# EAGLE design eth2rs485 (EAGLE 9.6.2)
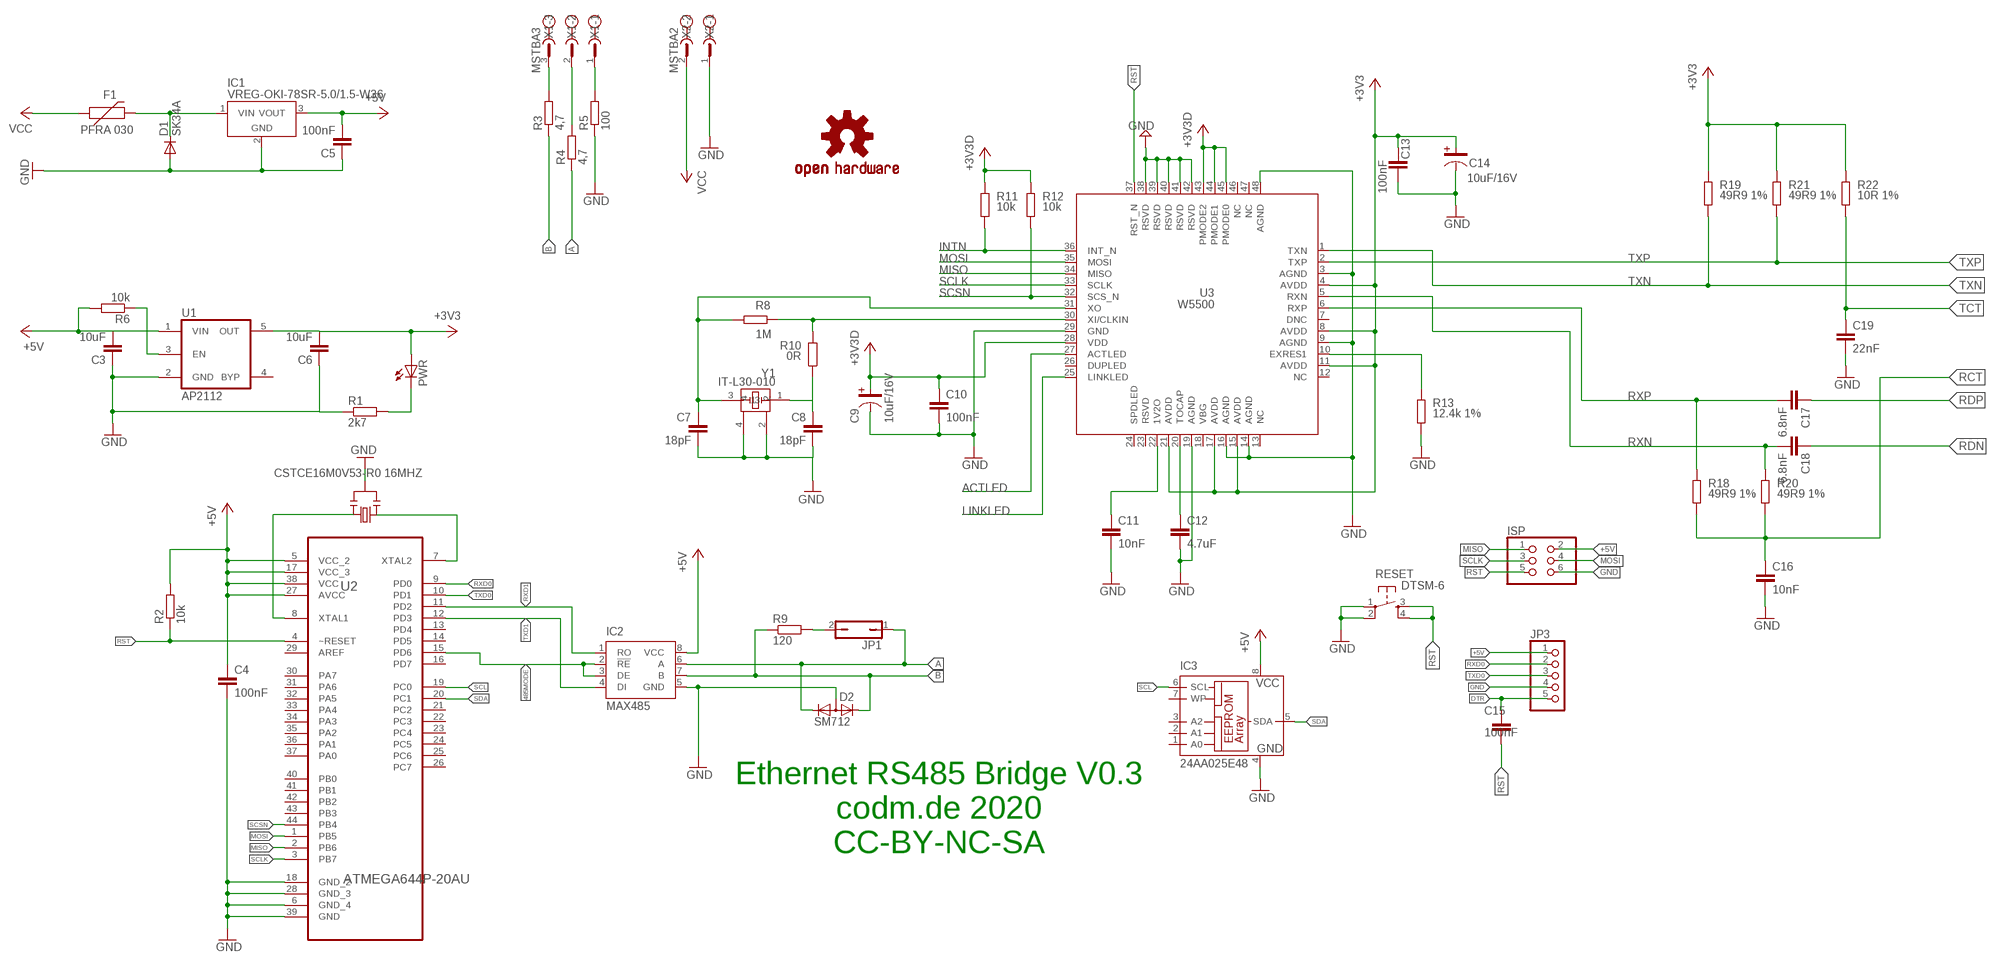
[diagram p0: schematic, sheet 1, part 1 of 2]
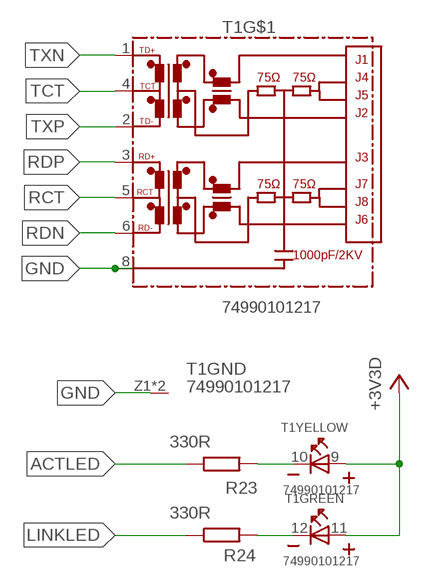
[diagram p1: schematic, sheet 1, part 2 of 2]

## Parts
C3  10uF  C-EUC0805  [C0805]
C4  100nF  C-EUC0805  [C0805]
C5  100nF  C-EUC0805  [C0805]
C6  10uF  C-EUC0805  [C0805]
C7  18pF  C-EUC0805  [C0805]
C8  18pF  C-EUC0805  [C0805]
C9  10uF/16V  C-3216(TANTAL)  [C-3216(TANTAL)]
C10  100nF  C-EUC0805  [C0805]
C11  10nF  C-EUC0805  [C0805]
C12  4.7uF  C-EUC0805  [C0805]
C13  100nF  C-EUC0805  [C0805]
C14  10uF/16V  C-3216(TANTAL)  [C-3216(TANTAL)]
C15  100nF  C-EUC0805  [C0805]
C16  10nF  C-EUC0805  [C0805]
C17  6.8nF  C-EUC0805  [C0805]
C18  6.8nF  C-EUC0805  [C0805]
C19  22nF  C-EUC0805  [C0805]
D1  SK34A  DIODE-DO214AC  [DO214AC]
D2  SM712  DIODE-2CA|ACSOT23  [SOT23]
F1  PFRA 030  PPTC_PTH  [PTH]
IC1  VREG-OKI-78SR-5.0/1.5-W36  [OKI-78SR]
IC2  MAX485  LTC485S  [SOIC8]
IC3  24AA025E48  24AA02SN  [SO-08]
ISP  PINHD-2X3  [2X03]
JP1  JP1Q  [JP1]
JP3  PINHD-1X5  [1X05]
LOGO1  OSHW-LOGOM  [OSHW-LOGO-M]
PWR  LEDCHIP-LED0805  [CHIP-LED0805]
R1  2k7  R-EU_R0805  [R0805]
R2  10k  R-EU_R0805  [R0805]
R3  4,7  R-EU_R0805  [R0805]
R4  4,7  R-EU_R0805  [R0805]
R5  100  R-EU_R0805  [R0805]
R6  10k  R-EU_R0805  [R0805]
R8  1M  R-EU_R0805  [R0805]
R9  120  R-EU_R0805  [R0805]
R10  0R  R-EU_R0805  [R0805]
R11  10k  R-EU_R0805  [R0805]
R12  10k  R-EU_R0805  [R0805]
R13  12.4k 1%  R-EU_R0805  [R0805]
R18  49R9 1%  R-EU_R0805  [R0805]
R19  49R9 1%  R-EU_R0805  [R0805]
R20  49R9 1%  R-EU_R0805  [R0805]
R21  49R9 1%  R-EU_R0805  [R0805]
R22  10R 1%  R-EU_R0805  [R0805]
R23  330R  R-EU_R0805  [R0805]
R24  330R  R-EU_R0805  [R0805]
RESET  DTSM-6  [DTSM-6]
T1  74990101217  WE-RJ45_74990111217  [74990111217]
U1  AP2112  AP2210K  [SOT23-5]
U2  ATMEGA644P-20AU  [QFP80P1200X1200X120-44N]
U3  W5500  [W5500]
X1  MSTBA3  [MSTBA3]
X2  MSTBA2  [MSTBA2]
Y1  IT-L30-010  [IT-L30-010]
Y2  CSTCE16M0V53-R0 16MHZ  RESONATORMU  [RESONATOR]

## Nets
485MODE: IC2.2(!RE) IC2.3(DE) U2.15(PD6)
+3V3: C6.2 C9.1 C10.1 C13.1 C14.1 PWR.A R11.2 R12.2 R19.2 R21.2 R22.2 T1.9(YELLOW:A) T1.11(GREEN:A) U1.5(OUT) U3.4(AVDD) U3.8(AVDD) U3.11(AVDD) U3.15(AVDD) U3.17(AVDD) U3.21(AVDD) U3.28(VDD) U3.43(PMODE2) U3.44(PMODE1) U3.45(PMODE0) ; supply symbol labelled +3V3D
+5V: C3.2 C4.1 C5.2 IC1.3(VOUT) IC2.8(VCC) IC3.8(VCC) ISP.2 JP3.1 R2.2 R6.2 U1.1(VIN) U2.5(VCC_2) U2.17(VCC_3) U2.27(AVCC) U2.38(VCC)
A: D2.1(K1) IC2.6(A) JP1.1 R4.1
ACTLED: R23.1 U3.27(ACTLED)
B: D2.2(K2) IC2.7(B) R3.1 R9.1
DTR: C15.1 JP3.5
GND: C3.1 C4.2 C5.1 C6.1 C7.2 C8.2 C9.2 C10.2 C11.2 C12.2 C13.2 C14.2 C16.2 C19.2 D1.A D2.3(A) IC1.2(GND) IC2.5(GND) IC3.4(GND) ISP.6 JP3.4 R1.1 R5.1 R13.1 RESET.1 RESET.2 T1.8 T1.Z1(GND:GND) T1.Z2(GND:GND) U1.2(GND) U2.6(GND_4) U2.18(GND_2) U2.28(GND_3) U2.39(GND) U3.3(AGND) U3.9(AGND) U3.14(AGND) U3.16(AGND) U3.19(AGND) U3.29(GND) U3.38(RSVD) U3.39(RSVD) U3.40(RSVD) U3.41(RSVD) U3.42(RSVD) U3.48(AGND) X2.1 Y1.2 Y1.4 Y2.2
INTN: R11.1 U3.36(INT_N)
LINKLED: R24.1 U3.25(LINKLED)
MISO: ISP.1 U2.2(PB6) U3.34(MISO)
MOSI: ISP.4 U2.1(PB5) U3.35(MOSI)
N$1: C12.1 U3.20(TOCAP)
N$2: R6.1 U1.3(EN)
N$4: R5.2 X1.1
N$5: R3.2 X1.3
N$6: R4.2 X1.2
N$7: PWR.C R1.2
N$8: D1.C F1.P$2 IC1.1(VIN)
N$11: R8.2 R10.2 U3.30(XI/CLKIN)
N$13: JP1.2 R9.2
N$15: C11.1 U3.22(1V2O)
N$17: R13.2 U3.10(EXRES1)
N$22: C7.1 R8.1 U3.31(XO) Y1.3
N$29: C8.1 R10.1 Y1.1
N$34: R23.2 T1.10(YELLOW:K)
N$35: R24.2 T1.12(GREEN:K)
RCT: C16.1 R18.1 R20.1 T1.5(RCT)
RDN: C18.1 T1.6(RD-)
RDP: C17.1 T1.3(RD+)
RST: C15.2 ISP.5 R2.1 RESET.3 RESET.4 U2.4(~RESET) U3.37(RST_N)
RXD0: JP3.2 U2.9(PD0)
RXD1: IC2.1(RO) U2.11(PD2)
RXN: C18.2 R20.2 U3.5(RXN)
RXP: C17.2 R18.2 U3.6(RXP)
SCL: IC3.6(SCL) U2.19(PC0)
SCLK: ISP.3 U2.3(PB7) U3.33(SCLK)
SCSN: R12.1 U2.44(PB4) U3.32(SCS_N)
SDA: IC3.5(SDA) U2.20(PC1)
TCT: C19.1 R22.1 T1.4(TCT)
TXD0: JP3.3 U2.10(PD1)
TXD1: IC2.4(DI) U2.12(PD3)
TXN: R19.1 T1.1(TD+) U3.1(TXN)
TXP: R21.1 T1.2(TD-) U3.2(TXP)
VCC: F1.P$1 X2.2
XTAL1: U2.8(XTAL1) Y2.3
XTAL2: U2.7(XTAL2) Y2.1
Unconnected: IC3.1(A0) IC3.2(A1) IC3.3(A2) IC3.7(WP) U1.4(BYP) U2.13(PD4) U2.14(PD5) U2.16(PD7) U2.21(PC2) U2.22(PC3) U2.23(PC4) U2.24(PC5) U2.25(PC6) U2.26(PC7) U2.29(AREF) U2.30(PA7) U2.31(PA6) U2.32(PA5) U2.33(PA4) U2.34(PA3) U2.35(PA2) U2.36(PA1) U2.37(PA0) U2.40(PB0) U2.41(PB1) U2.42(PB2) U2.43(PB3) U3.7(DNC) U3.12(NC) U3.13(NC) U3.18(VBG) U3.23(RSVD) U3.24(SPDLED) U3.26(DUPLED) U3.46(NC) U3.47(NC)

## Notes on the sheet
- Ethernet RS485 Bridge V0.3
  codm.de 2020
  CC-BY-NC-SA

## Library data of the parts
C3-C8 C10-C13 C15-C19 = rcl:C-EU: CAPACITOR, European symbol; SPICEPREFIX: C
C9 C14 = CAP:C-3216(TANTAL)
D1 = diode:DIODE-: DIODE
D2 = diode:DIODE-2CA|AC: Dual DIODE Cathode-Anode|Anode-Cathode
F1 = SparkFun-Fuses:PPTC: Resettable Fuse PPTC Resettable Fuse. Really a sort of resistor with a polymeric positive temperature coefficient whose resistance increases dramatically with an increase in temperature. When heated by the power passing through the resistance rises causing the current to be limited, protecting the circuit. This is achieved by the transition of the polymer from a crystalline to an amorphous state where the conductive carbon separates breaking the conductive pathways found in the cool crystalline structure. When a PPTC cools back down it resumes conducting letting the circuit turn back on. SparkFun Products: SparkFun RedBoard - Programmed with Arduino <https://www.sparkfun.com/products/12757> Pro Micro - 5V/16MHz <https://www.sparkfun.com/products/12640> Arduino Pro 328 - 5V/16MHz <https://www.sparkfun.com/products/10915> MP3 Trigger <https://www.sparkfun.com/products/13720>; PROD_ID: RES-08490; VALUE: 72V/0.25A
IC1 = we-power:VREG: Voltage Regulators (LDOs, Switching Converters...) LDOs Taiwan Semi TS1117 800mA max 15V - compatible On Semi NCP1117 1A max 20V - compatible Diodes AP2111H 0.6A max 6V (0.25V@0.6A) - compatible Diodes AP2114H 1A max 6V (0.45V@1A) Taiwan Semi TS9011 250mA max 12V - compatible Diodes AP2210 300mA max 15V - compatible Microchip MCP1700 250mA max 6.5V - compatible Microchip MCP1702 250mA max 13V - compatible Microchip MCP1703 250mA max 16V - compatible Microchip MCP1754 150mA max 16V Taiwan Semi TS5204 150mA max 16V (low noise) DC/DC Converter Modules Recom R-78Ex.x-1.0-W36 1A max 28V - compatible CUI V78xx-2000 2A max 18V Murata OKI-78SR-x.x/1.5-W36 1.5A max 36V
IC2 = linear-technology:LTC485: Low Power RS485 Interface Transceiver Source: http://www.linear.com/pc/downloadDocument.do?navId=H0,C1,C1007,C1017,P2064,D1718; OC_FARNELL: unknown; OC_NEWARK: unknown
IC3 = microchip:24*: Serial EEPROM I2C; MPN: 24AA02/SN; OC_FARNELL: 1331272; OC_NEWARK: 89C9793
ISP = pinhead:PINHD-2X3: PIN HEADER
JP1 = jumper:JP1Q: JUMPER
JP3 = pinhead:PINHD-1X5: PIN HEADER
LOGO1 = SparkFun-Aesthetics:OSHW-LOGO: Open-Source Hardware (OSHW) Logo This logo indicates the piece of hardware it is found on incorporates a OSHW license and/or adheres to the definition of open source hardware found here: http://freedomdefined.org/OSHW
PWR = led:LED: LED OSRAM: - CHIPLED LG R971, LG N971, LY N971, LG Q971, LY Q971, LO R971, LY R971 LH N974, LH R974 LS Q976, LO Q976, LY Q976 LO Q996 - Hyper CHIPLED LW Q18S LB Q993, LB Q99A, LB R99A - SideLED LS A670, LO A670, LY A670, LG A670, LP A670 LB A673, LV A673, LT A673, LW A673 LH A674 LY A675 LS A676, LA A676, LO A676, LY A676, LW A676 LS A679, LY A679, LG A679 - Hyper Micro SIDELED® LS Y876, LA Y876, LO Y876, LY Y876 LT Y87S - SmartLED LW L88C, LW L88S LB L89C, LB L89S, LG L890 LS L89K, LO L89K, LY L89K LS L896, LA L896, LO L896, LY L896 - TOPLED LS T670, LO T670, LY T670, LG T670, LP T670 LSG T670, LSP T670, LSY T670, LOP T670, LYG T670 LG T671, LOG T671, LSG T671 LB T673, LV T673, LT T673, LW T673 LH T674 LS T676, LA T676, LO T676, LY T676, LB T676, LH T676, LSB T676, LW T676 LB T67C, LV T67C, LT T67C, LS T67K, LO T67K, LY T67K, LW E67C LS E67B, LA E67B, LO E67B, LY E67B, LB E67C, LV E67C, LT E67C LW T67C LS T679, LY T679, LG T679 LS T770, LO T770, LY T770, LG T770, LP T770 LB T773, LV T773, LT T773, LW T773 LH T774 LS E675, LA E675, LY E675, LS T675 LS T776, LA T776, LO T776, LY T776, LB T776 LHGB T686 LT T68C, LB T68C - Hyper Mini TOPLED® LB M676 - Mini TOPLED Santana® LG M470 LS M47K, LO M47K, LY M47K Source: http://www.osram.convergy.de LUXEON: - LUMILED® LXK2-PW12-R00, LXK2-PW12-S00, LXK2-PW14-U00, LXK2-PW14-V00 LXK2-PM12-R00, LXK2-PM12-S00, LXK2-PM14-U00 LXK2-PE12-Q00, LXK2-PE12-R00, LXK2-PE12-S00, LXK2-PE14-T00, LXK2-PE14-U00 LXK2-PB12-K00, LXK2-PB12-L00, LXK2-PB12-M00, LXK2-PB14-N00, LXK2-PB14-P00, LXK2-PB14-Q00 LXK2-PR12-L00, LXK2-PR12-M00, LXK2-PR14-Q00, LXK2-PR14-R00 LXK2-PD12-Q00, LXK2-PD12-R00, LXK2-PD12-S00 LXK2-PH12-R00, LXK2-PH12-S00 LXK2-PL12-P00, LXK2-PL12-Q00, LXK2-PL12-R00 Source: www.luxeon.com KINGBRIGHT: KA-3528ASYC Source: www.kingbright.com
R1-R6 R8-R13 R18-R24 = rcl:R-EU_: RESISTOR, European symbol; SPICEPREFIX: R
RESET = switch-tact:DTSM-6
T1 = SignalCommunications (rev17d):WE-RJ45_74990111217: Order Code 74990111217 Design THT xBase-T 10/100 Base-T Ports 1x1 Application Standard HPLE Tab Position Up LED (Left-Right) yellow-green EMI Fingers YES <http://katalog.we-online.de/media/images/v2/Family_RJ45_drei(2).jpg> Details see: http://katalog.we-online.de/en/pbs/WE-LAN-RJ45/74990111217 <http://katalog.we-online.de/en/pbs/WE-LAN-RJ45/74990111217?> Created by Yingchun Shan 2014-07-10 2016 (C) Würth Elektronik
U1 = diodes-inc:AP2210: LDO REGULATOR
U2 = Atmel_By_element14_Batch_1-00:ATMEGA644P-20AU: 8-bit Microcontroller with Bytes In-System Programmable Flash; MPN: ATMEGA644P-20AU; OC_FARNELL: 1455121; OC_NEWARK: 58M3746; PACKAGE: TQFP-44; SUPPLIER: Atmel
U3 = W5500:W5500
X1 = con-phoenix-508:MSTBA3: PHOENIX; MF: FARNELL; MPN: 1757255; OC_FARNELL: 3705183; OC_NEWARK: 71C4162
X2 = con-phoenix-508:MSTBA2: PHOENIX; MF: FARNELL; MPN: 1757242; OC_FARNELL: 3705171; OC_NEWARK: 71C4161
Y1 = IT-L30-010:IT-L30-010
Y2 = SmartPrj:RESONATOR

## Board
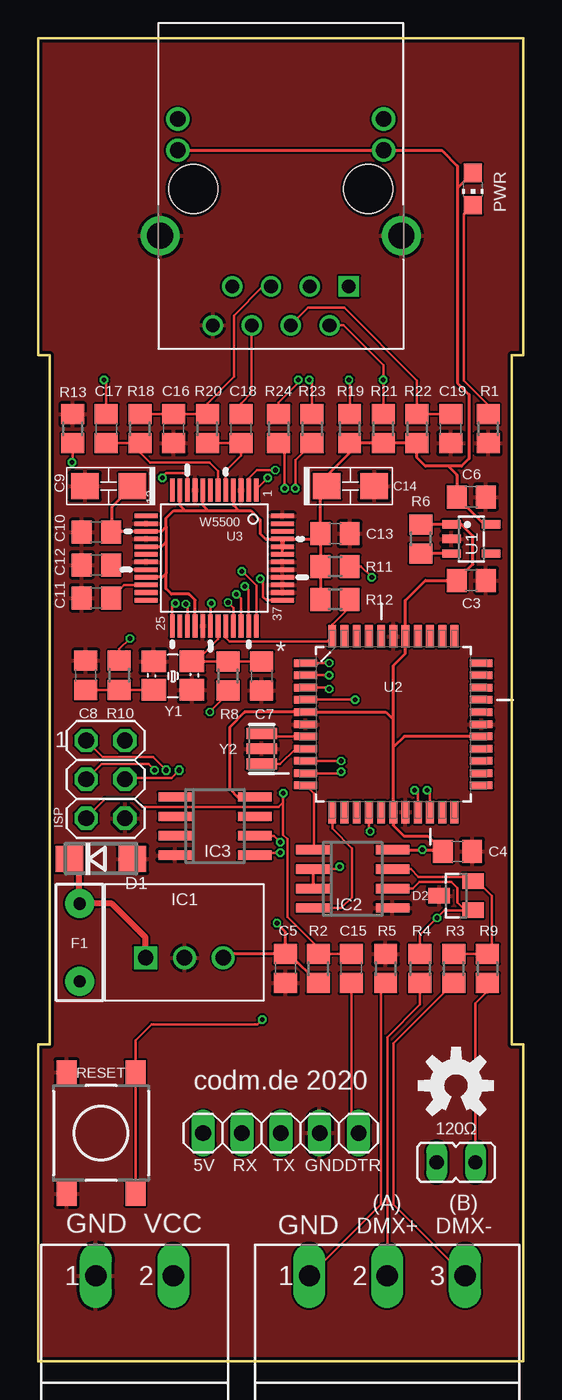
[diagram p2: board, top side]
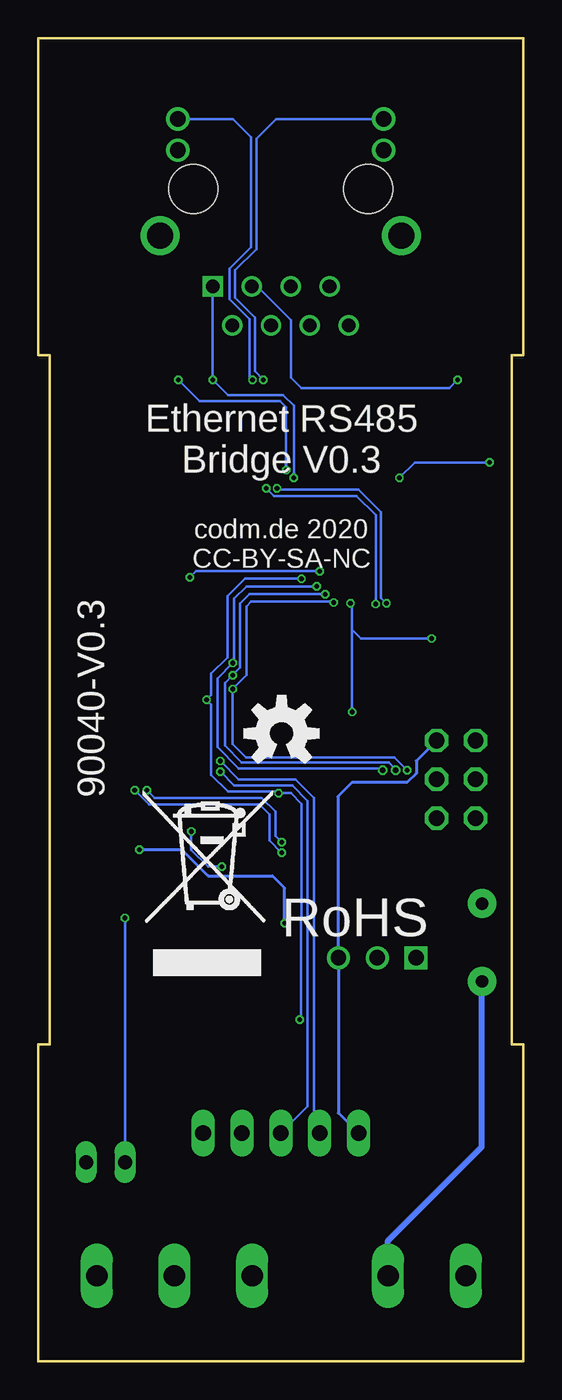
[diagram p3: board, bottom side, seen from below]

Size 31.7 x 86.4 mm. Coordinates in mm from the lower left corner, seen from the top.
Outline: 0,0 0,20.7 0.75,20.7 0.75,65.7 0,65.7 0,86.4 31.7,86.4 31.7,65.7 30.95,65.7 30.95,20.7 31.7,20.7 31.7,0 0,0
Copper layers (1*16): Top 0.018mm / dielectric 1.55mm / Bottom 0.018mm
Design rules "Multi-CB_2L_125um-Tracks_OL35um": minimum track width 0.125mm, minimum drill 0.2mm, track to track 0.125mm, track to pad 0.125mm, pad to pad 0.125mm, via to via 0.125mm, smd to smd 0mil, copper to edge 0.2mm, drill to drill 0.2mm, minimum pad ring 0.125mm, minimum via ring 0.125mm, stop-mask expansion 2mil, vias tented up to drill 0.45mm, thermal gap 0.2mm

### Footprints (pad centres in the part's own frame; a part is rotated, then mirrored left to right if it is on the bottom)
C0805 = smd 1.3 x 1.5: 1 -0.95,0; 2 0.95,0
C-3216(TANTAL) = smd 1.8 x 1.7: 1 1.55,0; 2 -1.55,0
DO214AC = smd 1.8 x 1.7: A 2.05,0; C -2.05,0
SOT23 = smd 1 x 1.4: 1 -0.95,-1.1; 2 0.95,-1.1; 3 0,1.1
PTH = drill 0.8 pad 1.88: P$1 -2.54,0; P$2 2.54,0
OKI-78SR = drill 1 pad 1.5 square: 1 -2.54,0 | drill 1 pad 1.5: 2 0,0; 3 2.54,0
SOIC8 = smd 0.6 x 2.2: 1 -1.905,-2.6; 2 -0.635,-2.6; 3 0.635,-2.6; 4 1.905,-2.6; 5 1.905,2.6; 6 0.635,2.6; 7 -0.635,2.6; 8 -1.905,2.6
SO-08 = smd 0.6 x 2.2: 1 -1.905,-2.6; 2 -0.635,-2.6; 3 0.635,-2.6; 4 1.905,-2.6; 5 1.905,2.6; 6 0.635,2.6; 7 -0.635,2.6; 8 -1.905,2.6
2X03 = drill 1.016 octagon: 1 -2.54,-1.27; 2 -2.54,1.27; 3 0,-1.27; 4 0,1.27; 5 2.54,-1.27; 6 2.54,1.27
JP1 = drill 0.914 long: 1 0,-1.27; 2 0,1.27
1X05 = drill 1.016 long: 1 -5.08,0; 2 -2.54,0; 3 0,0; 4 2.54,0; 5 5.08,0
CHIP-LED0805 = smd 1.2 x 1.2: A 0,-1.05; C 0,1.05
R0805 = smd 1.3 x 1.5: 1 -0.95,0; 2 0.95,0
DTSM-6 = smd 1.55 x 1.3: 1 -3.975,2.25; 2 3.975,2.25; 3 -3.975,-2.25; 4 3.975,-2.25
74990111217 = drill 0.89 square: 1 4.44,-6.35 | drill 0.89: 2 3.18,-8.89; 3 1.9,-6.35; 4 0.64,-8.89; 5 -0.64,-6.35; 6 -1.9,-8.89; 7 -3.18,-6.35; 8 -4.44,-8.89 | drill 1.02: 9 6.725,2.54; 10 6.725,4.57; 11 -6.725,2.54; 12 -6.725,4.57 | drill 1.7: Z1 -7.875,-3.05; Z2 7.875,-3.05 | hole 3.2: -5.715,0; 5.715,0
SOT23-5 = smd 0.55 x 1.2: 1 -0.95,-1.3; 2 0,-1.3; 3 0.95,-1.3; 4 0.95,1.3; 5 -0.95,1.3
QFP80P1200X1200X120-44N = smd 1.473 x 0.508: 1 -5.74,3.988; 2 -5.74,3.2; 3 -5.74,2.388; 4 -5.74,1.6; 5 -5.74,0.787; 6 -5.74,0; 7 -5.74,-0.787; 8 -5.74,-1.6; 9 -5.74,-2.388; 10 -5.74,-3.2; 11 -5.74,-3.988; 23 5.74,-3.988; 24 5.74,-3.2; 25 5.74,-2.388; 26 5.74,-1.6; 27 5.74,-0.787; 28 5.74,0; 29 5.74,0.787; 30 5.74,1.6; 31 5.74,2.388; 32 5.74,3.2; 33 5.74,3.988 | smd 0.508 x 1.473: 12 -3.988,-5.74; 13 -3.2,-5.74; 14 -2.388,-5.74; 15 -1.6,-5.74; 16 -0.787,-5.74; 17 0,-5.74; 18 0.787,-5.74; 19 1.6,-5.74; 20 2.388,-5.74; 21 3.2,-5.74; 22 3.988,-5.74; 34 3.988,5.74; 35 3.2,5.74; 36 2.388,5.74; 37 1.6,5.74; 38 0.787,5.74; 39 0,5.74; 40 -0.787,5.74; 41 -1.6,5.74; 42 -2.388,5.74; 43 -3.2,5.74; 44 -3.988,5.74
W5500 = smd 1.5 x 0.3: 1 -4.45,2.75; 2 -4.45,2.25; 3 -4.45,1.75; 4 -4.45,1.25; 5 -4.45,0.75; 6 -4.45,0.25; 7 -4.45,-0.25; 8 -4.45,-0.75; 9 -4.45,-1.25; 10 -4.45,-1.75; 11 -4.45,-2.25; 12 -4.45,-2.75; 25 4.45,-2.75; 26 4.45,-2.25; 27 4.45,-1.75; 28 4.45,-1.25; 29 4.45,-0.75; 30 4.45,-0.25; 31 4.45,0.25; 32 4.45,0.75; 33 4.45,1.25; 34 4.45,1.75; 35 4.45,2.25; 36 4.45,2.75 | smd 0.3 x 1.5: 13 -2.75,-4.45; 14 -2.25,-4.45; 15 -1.75,-4.45; 16 -1.25,-4.45; 17 -0.75,-4.45; 18 -0.25,-4.45; 19 0.25,-4.45; 20 0.75,-4.45; 21 1.25,-4.45; 22 1.75,-4.45; 23 2.25,-4.45; 24 2.75,-4.45; 37 2.75,4.45; 38 2.25,4.45; 39 1.75,4.45; 40 1.25,4.45; 41 0.75,4.45; 42 0.25,4.45; 43 -0.25,4.45; 44 -0.75,4.45; 45 -1.25,4.45; 46 -1.75,4.45; 47 -2.25,4.45; 48 -2.75,4.45
MSTBA3 = drill 1.397 long: 1 -5.08,5.08; 2 0,5.08; 3 5.08,5.08
MSTBA2 = drill 1.397 long: 1 -2.54,5.08; 2 2.54,5.08
IT-L30-010 = smd 1.6 x 1.4: 1 -1.25,0; 2 1.25,0; 3 1.25,1.85; 4 -1.25,1.85
RESONATOR = smd 0.7 x 2: 1 -1,0; 2 0,0; 3 1,0

### Placement (x,y rotation side)
C3  28.3,51 180 top
C4  27.4,33.3 0 top
C5  16.15,25.65 90 top
C6  28.3,56.45 180 top
C7  14.6,44.75 270 top
C8  3.1,44.8 90 top
C9  4.6,57.15 0 top
C10  3.8,54.15 180 top
C11  3.8,49.85 180 top
C12  3.8,52 180 top
C13  19.4,54.05 0 top
C14  20.4,57.15 180 top
C15  20.45,25.65 90 top
C16  8.85,60.9 270 top
C17  4.45,60.9 270 top
C18  13.25,60.9 270 top
C19  26.95,60.9 270 top
D1  4.1,32.8 0 top
D2  27.3,30.4 90 top
F1  2.7,27.35 90 top
IC1  9.55,26.35 0 top
IC2  20.55,31.5 270 top
IC3  11.55,34.95 270 top
ISP  4.4,38 270 top
JP1  27.3,13 270 top
JP3  15.85,14.9 0 top
LOGO1  27.3,18 0 top
LOGO2  OSHW-LOGOM  [OSHW-LOGO-M]  15.8,41 0 bottom
PWR  28.4,76.55 180 top
R1  29.4,60.9 90 top
R2  18.3,25.65 270 top
R3  27.15,25.65 270 top
R4  24.95,25.65 270 top
R5  22.7,25.65 270 top
R6  25,53.7 90 top
R8  12.4,44.75 270 top
R9  29.35,25.65 270 top
R10  5.3,44.8 90 top
R11  19.4,51.9 180 top
R12  19.4,49.75 180 top
R13  2.25,60.9 270 top
R18  6.65,60.9 270 top
R19  20.35,60.9 270 top
R20  11.05,60.9 270 top
R21  22.55,60.9 270 top
R22  24.75,60.9 270 top
R23  17.9,60.9 90 top
R24  15.7,60.9 90 top
RESET  4.1,14.9 90 top
T1  15.85,76.55 0 top
U1  28.3,53.7 270 top
U2  23.2,41.6 0 top
U3  11.5,52.45 270 top
U$3  [WEEE-LOGO-8MM]  24.88,25.19 0 bottom
X1  22.8,0.5 0 top
X2  6.3,0.5 0 top
Y1  8.8,43.85 0 top
Y2  14.6,40 270 top

### Tracks (layer width: path | path; a pad name or v marks a point on that pad's centre or on a via)
485MODE  (via drill 0.3)
  Top 0.152: v19.7,32.3 19.54,32.13 IC2.2 | v21.7,34.6 21.6,34.7 U2.15
  Top 0.203: IC2.2 IC2.3
  Bottom 0.152: v19.7,32.3 20.6,32.3 21.7,33.4 v21.7,34.6
+3V3
  Top 0.203: U3.43 U3.45 | 8.35,53.5 8.35,51.45 | 8.35,54.5 8.35,53.5 | 8.35,54.5 8.35,55.05 8.85,55.55 9.6,55.55 | U3.17 8.05,53.2 8.35,53.5 | 8.35,54.5 8.05,54.2 U3.15 4.8,54.2 4.8,55.8 C9.1 | 9.6,55.55 11.1,55.55 | 11.1,55.55 13.1,55.55 | 13.1,55.55 13.9,55.55 14.5,54.95 14.5,54.05 14.85,53.7 U3.45 | U3.28 10.25,49.7 9.85,50.1 8.7,50.1 8.35,50.45 8.35,51.45 | 8.35,51.45 8.1,51.2 U3.21 | 29.15,54.65 C6.2 27.35,57.9 26.8,58.45 | T1.11 T1.9 26.36,79.09 27.4,78.05 27.4,76.6 | C13.1 R11.2 R12.2 | U3.45 18.1,53.7 C13.1 | C13.1 18.45,56.65 C14.1 18.85,57.85 20.35,59.35 R19.2 R21.2 R22.2 24.75,59 25.3,58.45 26.8,58.45 | U3.8 10.75,55.9 11.1,55.55 | U3.4 12.75,55.9 13.1,55.55 | U3.11 9.25,55.9 9.6,55.55 | 27.4,76.6 27.4,63.88 28.14,63.14 28.14,58.94 27.65,58.45 26.8,58.45 | PWR.A 27.4,76.6
  Top 0.254: U1.5 29.15,54.65 | 4.8,54.2 C10.1
  Top 0.305: U3.45 U3.44
+5V  (via drill 0.3)
  Top 0.203: IC1.3 12.34,26.6 C5.2 16.15,28.05 v15.6,28.6 | 16.4,26.6 R2.2 | R6.2 U1.1 27.65,54.65 28.4,53.9 28.4,52.05 C3.2 25.3,51 23.99,49.69 U2.38 23.99,46.21 23.2,45.42 23.2,41.9 | 23.2,40.1 U2.17 23.2,35 23.9,34.3 25.45,34.3 26.27,33.48 | 23.2,40.1 23.2,41.9 | U2.27 23.91,40.81 23.2,40.1 | 23.2,41.9 22.71,42.39 U2.5 13.49,42.39 12.5,41.4 12.5,37.4 13.1,36.8 14.1,36.8 IC3.8 | 26.27,33.48 C4.1 | IC2.8 v25.1,33.41 26.2,33.41 26.27,33.48
  Top 0.254: C5.2 16.4,26.6
  Bottom 0.203: JP3.1 12.09,16.22 IC1.3 12.12,26.38 12.12,36.88 11.2,37.8 7.6,37.8 7,38.4 7,39.21 ISP.2 | v15.6,28.6 15.6,30.9 16.4,31.7 20.59,31.7 22.3,33.41 v25.1,33.41
A  (via drill 0.3)
  Top 0.152: IC2.6 24.46,30.86 24.9,31.3 27,31.3 27.4,30.9 27.4,29.95 27.9,29.45 | D2.1 27.9,29.45 | 27.9,29.45 26.55,29.45 v26.05,28.95 24.95,27.85 R4.1
  Bottom 0.152: JP1.1 26.03,28.93 v26.05,28.95
ACTLED  (via drill 0.3)
  Top 0.152: v9.65,49.45 9.75,49.35 U3.27 | v16.8,57 16.8,58.85 R23.1
  Bottom 0.152: v9.65,49.45 9.65,55.25 10.9,56.5 16.3,56.5 v16.8,57
B
  Top 0.152: R3.1 R9.1 29.65,26.9 29.65,30.4 28.7,31.35 D2.2 28.11,31.64 24.85,31.64 24.35,32.13 IC2.7
DTR
  Top 0.152: JP3.5 20.93,15.47 20.45,15.95 C15.1
GND
  pour Top: 0,0 0,87 32.1,87 32,0
INTN  (via drill 0.3)
  Top 0.152: U3.36 14.25,50.65 v13.3,51.6 | v21.8,51.2 21.1,51.9 R11.1
  Bottom 0.152: v13.3,51.6 21.4,51.6 v21.8,51.2
LINKLED  (via drill 0.3)
  Top 0.152: U3.25 8.75,49.3 v8.95,49.5 | v16.1,57 16.1,59.55 R24.1
  Bottom 0.152: v8.95,49.5 9.3,49.85 9.3,55.45 10.77,56.93 16,56.93 v16.1,57
MISO  (via drill 0.3, 0.35)
  Top 0.152: U3.34 13.25,49.8 v12.95,50.1 | v19,44.8 | v19,44.8 U2.2 | v8.35,38.6 8.35,38.62 7.5,39.48 4.19,39.48 ISP.1
  Bottom 0.152: v12.95,50.1 17.9,50.1 18.5,49.5 18.5,45.3 v19,44.8 19.5,44.3 19.5,40.2 18.4,39.1 8.79,39.1 8.35,38.66 v8.35,38.6
MOSI  (via drill 0.3, 0.35)
  Top 0.152: U3.35 13.75,50.35 v13.5,50.6 | v19,45.6 18.99,45.59 U2.1 | ISP.4 5.77,38.1 8.7,38.1 v9.2,38.6
  Bottom 0.152: v13.5,50.6 18.1,50.6 18.9,49.8 18.9,45.7 v19,45.6 20,44.6 20,40.1 18.6,38.7 9.3,38.7 v9.2,38.6
N$1
  Top 0.152: U3.20 5.05,51.7 C12.1
N$2
  Top 0.203: U1.3 R6.1
N$4
  Top 0.152: R5.2 22.4,24.4 22.4,10.26 X1.1
N$5
  Top 0.152: X1.3 23.2,10.26 23.2,20.75 R3.2
N$6
  Top 0.152: R4.2 24.95,23.3 22.8,21.15 X1.2
N$7
  Top 0.152: PWR.C 27.8,74.9 27.8,64.05 29.4,62.45 R1.2
N$8
  Top 0.406: IC1.1 7.01,27.68 4.8,29.89 F1.P$2 2.65,29.94 2.65,32.2 D1.C
N$11  (via drill 0.3)
  Top 0.152: R8.2 12.4,43.6 v11.2,42.4 | v11.3,49.5 11.25,49.45 U3.30 | R10.2 5.3,46.5 v6,47.2
  Bottom 0.152: 11.2,47.8 v11.2,42.4 | 11.2,47.8 11.2,49.4 v11.3,49.5 | v6,47.2 10.6,47.2 11.2,47.8
N$13
  Top 0.152: JP1.2 28.57,23.37 29.35,24.15
  Top 0.254: 29.35,24.15 R9.2
N$15
  Top 0.152: U3.22 5.6,50.7 C11.1
N$17  (via drill 0.3)
  Top 0.152: U3.10 9.75,57.75 9.5,58 8.37,58 8.1,57.73 v8.1,57.7 | v2.2,58.7 2.25,58.75 R13.2
  Bottom 0.152: v8.1,57.7 7.1,58.7 v2.2,58.7
N$22
  Top 0.152: C7.1 R8.1 10.3,45.7 | 10.3,45.7 10.1,45.7 | U3.31 11.75,47.15 10.3,45.7
  Top 0.254: 10.1,45.7 Y1.3
N$29
  Top 0.152: C8.1 R10.1 Y1.1
N$34  (via drill 0.3)
  Top 0.152: R23.2 17.9,63.9 v17.7,64.1
  Bottom 0.152: T1.10 18.98,81.12 17.8,79.94 17.8,72.74 19.19,71.35 19.19,69.35 17.9,68.06 17.9,64.3 v17.7,64.1
N$35  (via drill 0.3)
  Top 0.152: R24.2 15.7,62.6 17,63.9 v17,64.1
  Bottom 0.152: v17,64.1 17.55,64.65 17.55,68.16 18.84,69.45 18.84,71.25 17.45,72.64 17.45,79.85 16.18,81.12 T1.12
RCT
  Top 0.152: T1.5 14.7,70.2 12.8,68.3 12.8,64.3 11.05,62.55 R20.1 C16.1 R18.1
RDN
  Top 0.152: C18.1 13.25,62.55 13.95,63.25 T1.6
RDP  (via drill 0.3)
  Top 0.152: C17.1 4.45,63.95 v4.3,64.1
  Bottom 0.152: 17.4,70.2 15.2,68 15.2,64.25 14.5,63.55 4.85,63.55 v4.3,64.1
  Bottom 0.254: 17.4,70.2 T1.3
RST  (via drill 0.3)
  Top 0.152: RESET.3 RESET.4 6.35,20.95 7.4,22 14.33,22 v14.63,22.3 | C15.2 R2.1 18.3,27 16.28,29.02 16.28,34.1 16,34.37 16,36.5 | v20.7,43.2 | v20.7,43.2 U2.4 | U3.37 14.9,49.7 14.7,49.9 14.7,50.9 v14.5,51.1 | ISP.5 3.13,35.48 4.37,36.72 6.27,36.72 6.79,36.2 15.7,36.2 16,36.5 | 16,36.5 v16,37.1
  Bottom 0.152: v14.5,51.1 18.2,51.1 19.33,49.97 19.33,45.97 20.4,44.9 20.4,43.5 v20.7,43.2 20.4,42.9 20.4,38.3 19.3,37.2 16.1,37.2 v16,37.1 15.2,37.1 14.5,36.4 14.5,28.9 14.53,28.87 14.53,22.4 v14.63,22.3
RXD0  (via drill 0.3)
  Top 0.152: v19.8,39.2 17.47,39.2 U2.9
  Bottom 0.152: v19.8,39.2 18.6,38 14.9,38 13.7,36.8 13.7,15.29 JP3.2
RXD1
  Top 0.152: U2.11 18,37.07 18,33.45 IC2.1
RXN
  Top 0.152: R20.2 C18.2 13.25,59.15 12.25,58.15 U3.5
RXP
  Top 0.152: U3.6 11.75,58.15 11.2,58.7 7.3,58.7 6.65,59.35 R18.2 C17.2
SCL  (via drill 0.3)
  Top 0.152: U2.19 24.8,37.1 v24.6,37.3 | v15.8,33.9 15.4,34.3 14.16,34.3
  Top 0.2: 14.16,34.3 IC3.6
  Bottom 0.152: v24.6,37.3 24.1,36.8 17.1,36.8 16.2,35.9 16.2,34.3 v15.8,33.9
SCLK  (via drill 0.3)
  Top 0.152: U3.33 12.75,49.2 v12.4,49.55 | v19,43.9 18.91,43.99 U2.3 | ISP.3 4.13,39 7.2,39 v7.6,38.6
  Bottom 0.152: v12.4,49.55 12.45,49.6 17.8,49.6 18.1,49.3 18.1,44.8 v19,43.9 19,40.3 18.13,39.43 8.43,39.43 v7.6,38.6
SCSN
  Top 0.152: U3.32 12.25,47.25 12.5,47 18.87,47 U2.44 19.21,48.11 20.35,49.25 R12.1
SDA  (via drill 0.3)
  Top 0.152: U2.20 25.59,37.11 v25.4,37.3 | IC3.5 14.3,33.2 v15.8,33.2
  Bottom 0.152: v25.4,37.3 24.45,36.35 17.25,36.35 16.6,35.7 16.6,34 v15.8,33.2
TCT
  Top 0.152: T1.4 17.63,68.8 20,68.8 24.75,64.05 R22.1 C19.1
TXD0  (via drill 0.3)
  Top 0.152: v19.8,38.5 19.7,38.4 U2.10
  Bottom 0.152: JP3.3 14.1,16.65 14.1,36.6 15.1,37.6 18.9,37.6 v19.8,38.5
TXD1
  Top 0.152: U2.12 19.21,34.79 20.5,33.5 20.5,30.3 19.8,29.59 IC2.4
TXN  (via drill 0.3)
  Top 0.152: v20.3,64.1 20.35,64.05 R19.1 | v15,57.7 14.25,56.95 U3.1
  Bottom 0.152: T1.1 v20.3,64.1 19.3,63.1 15.7,63.1 15,62.4 v15,57.7
TXP  (via drill 0.3)
  Top 0.152: T1.2 19.94,67.66 22.55,65.05 v22.55,64.1 R21.1 | U3.2 13.75,57.65 14.3,58.2 v15.5,58.2
  Bottom 0.152: v15.5,58.2 15.5,62.3 15.9,62.7 21.15,62.7 v22.55,64.1
VCC
  Bottom 0.406: X2.2 8.84,7.88 2.74,13.98 2.74,24.77 F1.P$1
XTAL1
  Top 0.152: U2.8 16.8,40 15.8,39 Y2.3
XTAL2
  Top 0.152: U2.7 14.79,40.81 Y2.1

### Text on the board
tNames: 1 | codm.de 2020 | 120Ω | 5V | RX | TX | GND | DTR | (A) / DMX+ | (B) / DMX- | GND | VCC | GND
bNames: Ethernet RS485 / Bridge V0.3 | codm.de 2020 / CC-BY-SA-NC | 90040-V0.3 | RoHS
tValues: 5V FOCA